# Altium schematic sheet VFDPower.SchDoc
size A4
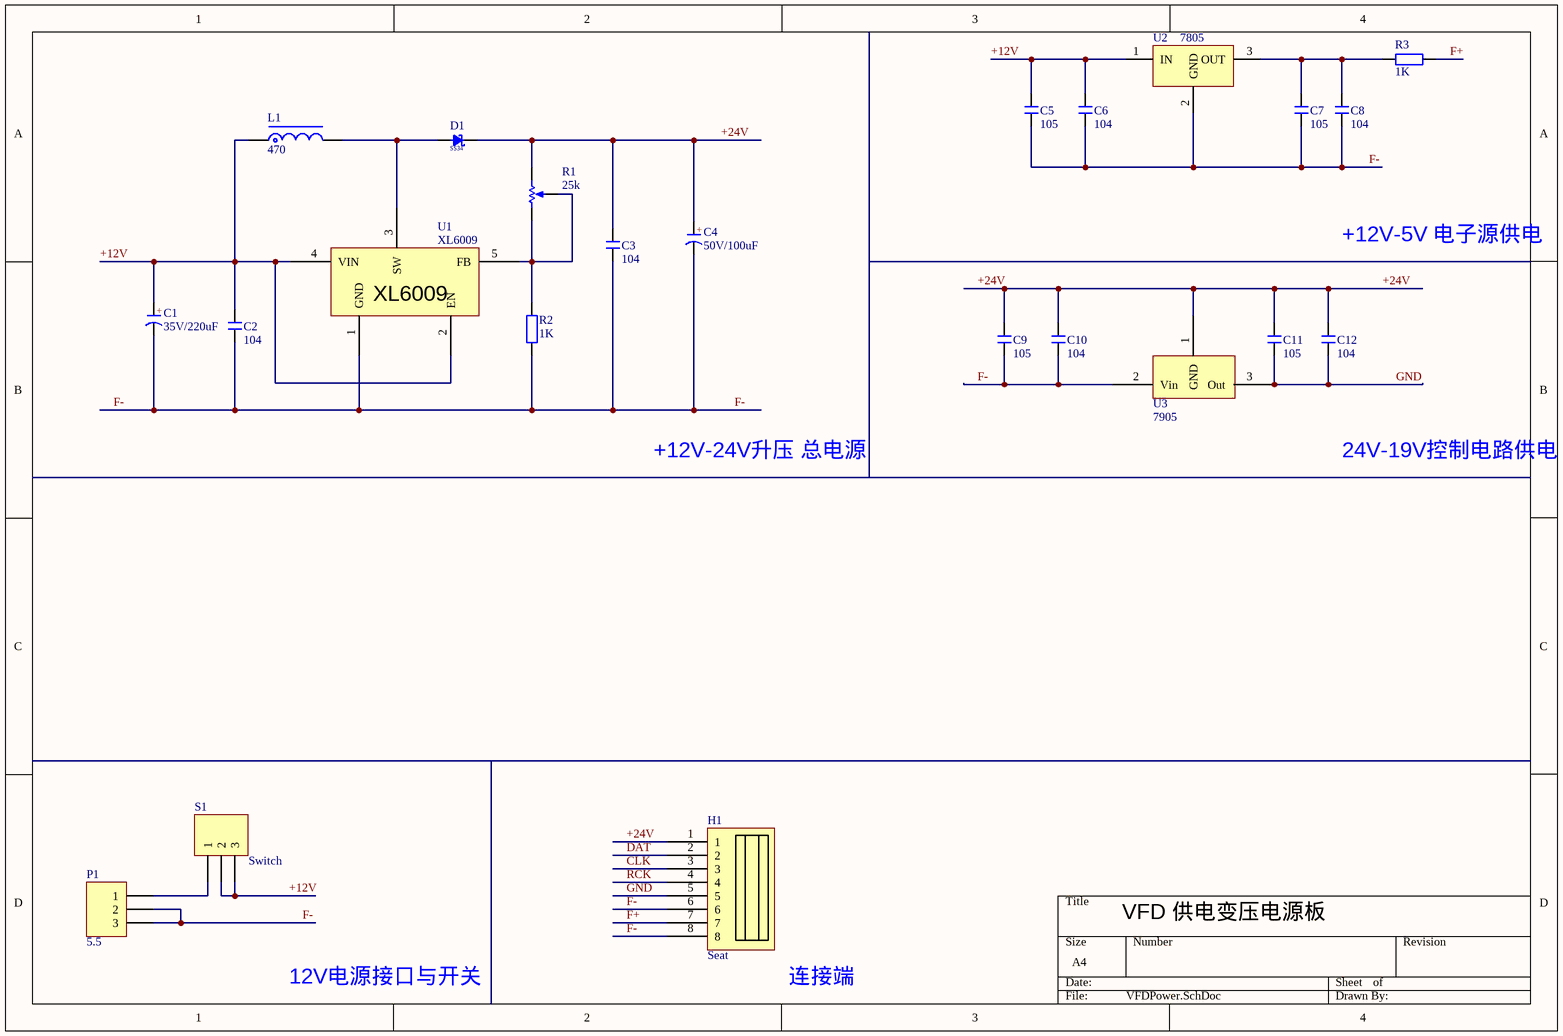
[diagram p0: VFDPower.SchDoc]

## Parts
C1  35V/220uF  [CM D(6.3*5.4)]
C2  104  [C 0805]
C3  104  [C 0805]
C4  50V/100uF  [CM D(6.3*5.4)]
C5  105  [C 0805]
C6  104  [C 0805]
C7  105  [C 0805]
C8  104  [C 0805]
C9  105  [C 0805]
C10  104  [C 0805]
C11  105  [C 0805]
C12  104  [C 0805]
D1  value SS34  [DO-214-M7-  4007贴片]  (hidden comment: D 肖特基)
H1  Seat  [SEAT8]
L1  470  [CDRH127]
P1  5.5  [DC-5.5*2.1]
R1  value 25k  [VR5]  (hidden comment: RPot)
R2  1K  [R 0805]
R3  1K  [R 0805]
S1  Switch  [HDR1X3]
U1  XL6009  [TO-263(T)]
U2  7805  [TO-263]
U3  7905  [TO-263]

## Nets
+12V: C1.1(A) C2.2 C5.2 C6.2 L1.1 S1.2 S1.3 U1.2(EN) U1.4(VIN) U2.1(IN)
+24V: C3.2 C4.1(A) C9.2 C10.2 C11.2 C12.2 D1.2(K) H1.1 R1.1(BOT) U3.1(GND)
CLK: H1.3
DAT: H1.2
F+: H1.7 R3.2
F-: C1.2(K) C2.1 C3.1 C4.2(K) C5.1 C6.1 C7.1 C8.2 C9.1 C10.1 H1.6 H1.8 P1.2 P1.3 R2.1 U1.1(GND) U2.2(GND) U3.2(Vin)
GND: C11.1 C12.1 H1.5 U3.3(Out)
RCK: H1.4
NetC7_2: C7.2 C8.1 R3.1 U2.3(OUT)
NetD1_1: D1.1(A) L1.2 U1.3(SW)
NetP1_1: P1.1 S1.1
NetR1_2: R1.2(TAP) R1.3(TOP) R2.2 U1.5(FB)

## Notes on the sheet
- +12V-5V 电子源供电
- +12V-24V升压 总电源
- 24V-19V控制电路供电
- VFD 供电变压电源板
- 12V电源接口与开关
- 连接端
- (in symbol C-CM) +

## Library data of the parts
C1 C4 = C-CM: 贴片电解电容; 版权归属: 源创客; BOM名称: 贴片电解电容; 学习资源: www.ooocke.com
C2 C3 C5-C12 = C: 无极性贴片电容; 版权归属: 源创客; BOM名称: 无极性贴片电容; 学习资源: www.ooocke.com
L1 = L-CDRH: 功率屏蔽电感; 版权归属: 源创客; BOM名称: 功率屏蔽电感; 学习资源: www.ooocke.com
P1 S1 = Header 3: Header, 3-Pin; LatestRevisionDate: 17-Jul-2002; LatestRevisionNote: Re-released for DXP Platform.; Publisher: Altium Limited
R1 = RPot: Potentiometer; Sim Note: Enter the Resistance value and the set point into parameter fields.; Set Position: 0.5; Published: 8-Jun-2000; LatestRevisionDate: 17-Jul-2002; LatestRevisionNote: Re-released for DXP Platform.; PackageReference: VR5; Publisher: Altium Limited; PackageDescription: Variable Resistor, Thru-Hole; 3 Leads
R2 R3 = R: 贴片电阻; 版权归属: 源创客; BOM名称: 贴片电阻; 学习资源: www.ooocke.com
U2 = 78XX
U3 = 79**
D1 = D 肖特基: Published: 8-Jun-2000; LatestRevisionDate: 17-Jul-2002; LatestRevisionNote: Re-released for DXP Platform.; PackageReference: SMB; Publisher: Altium Limited; PackageDescription: DO-214-AA/SMB; 2 C-Bend Leads; Body 5.3 x 3.6 mm, inc. leads (LxW); Code_JEDEC: DO-214-AA